# Altium schematic sheet UART.SchDoc
size A2; SheetNumber: 19; SheetTotal: 29
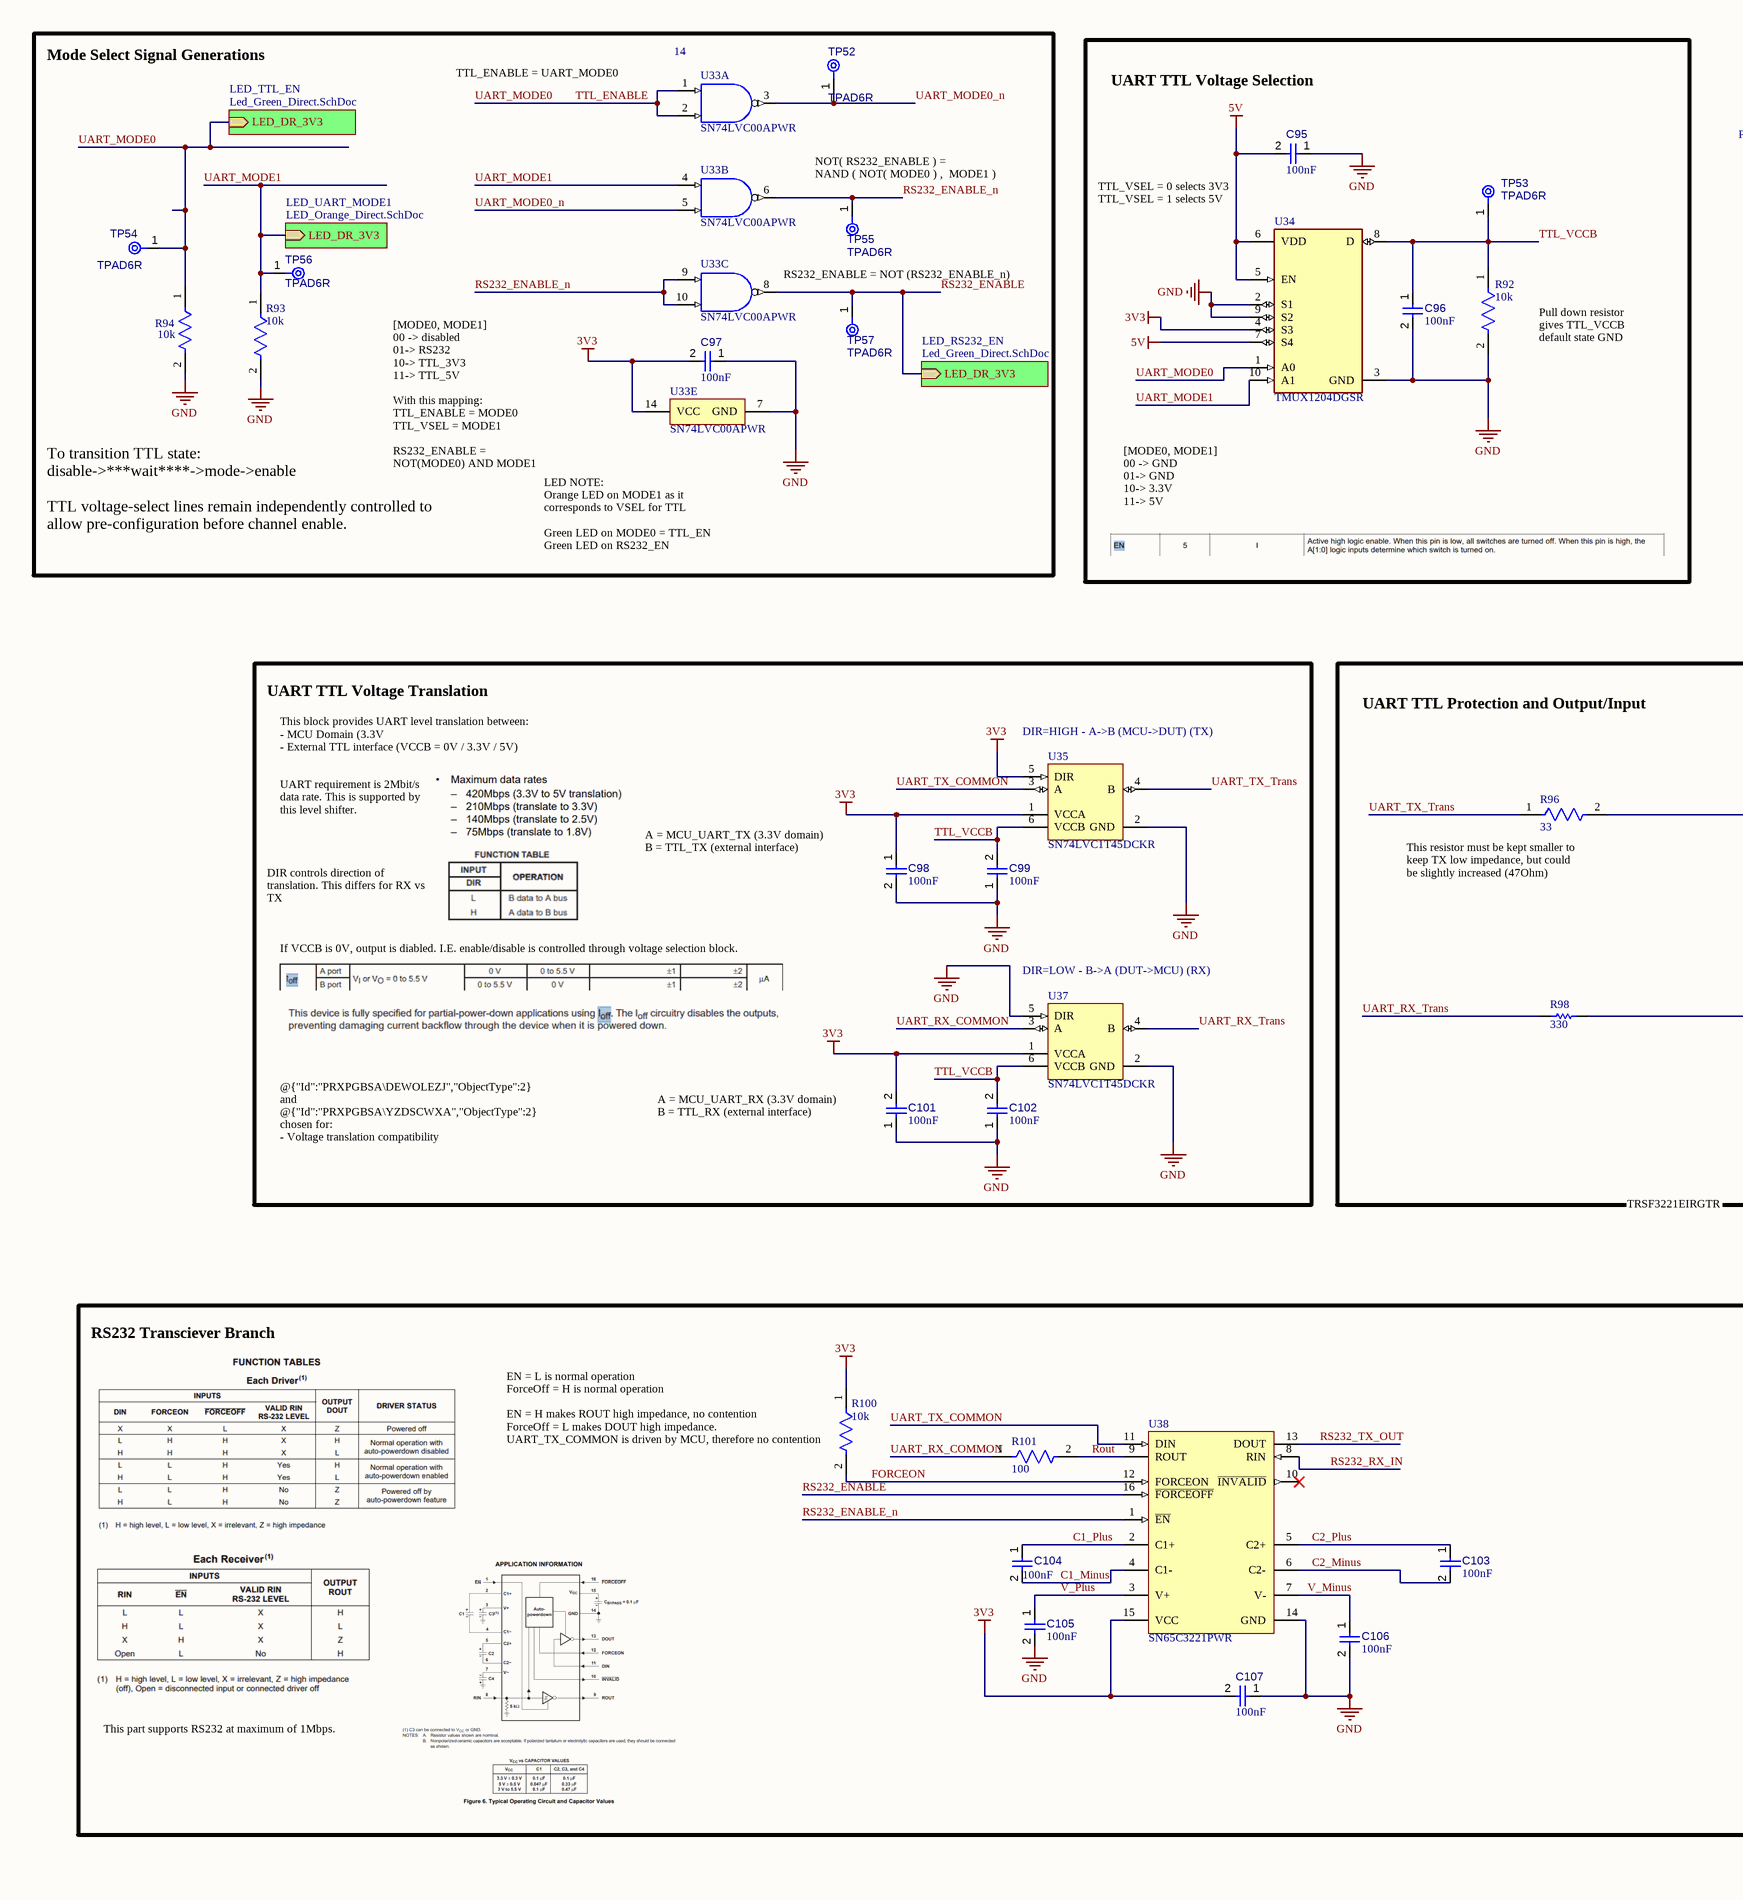
[diagram p0: UART.SchDoc, left]
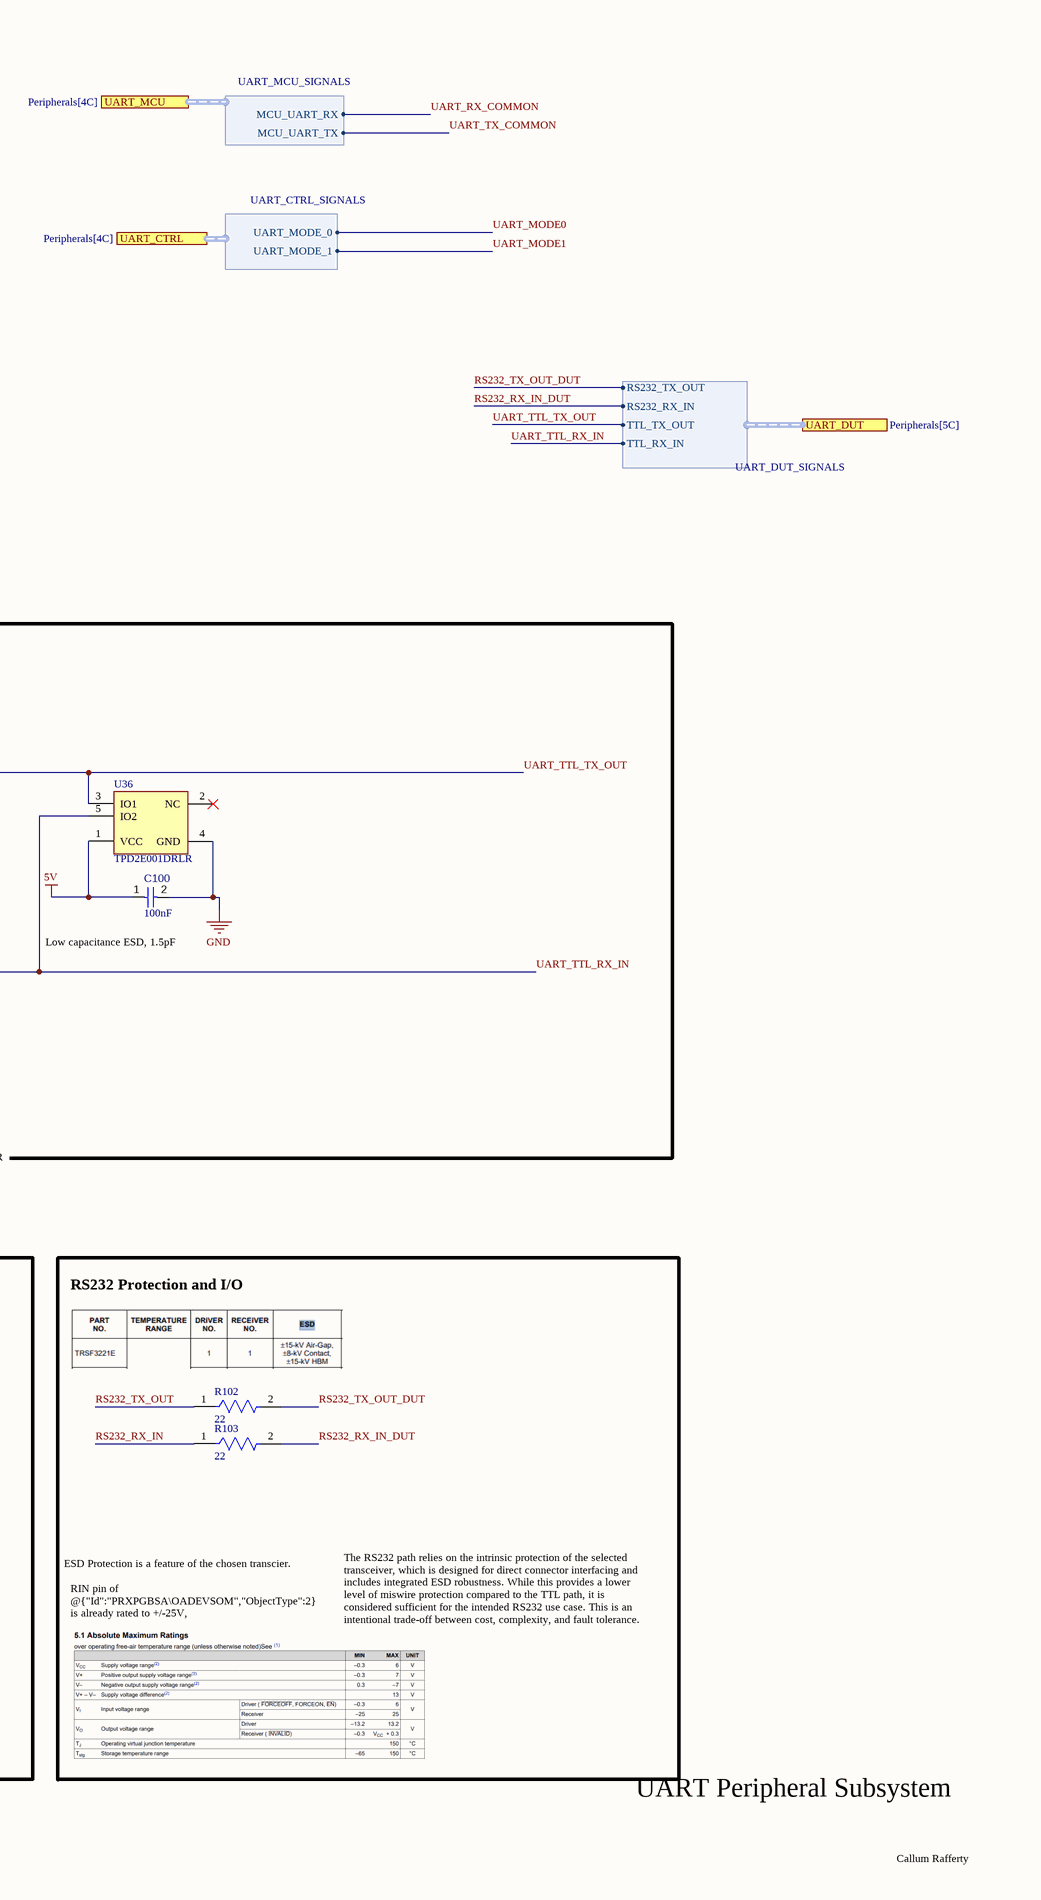
[diagram p1: UART.SchDoc, right]

## Parts
C95  value 100nF  [CAPC1608X90X40NL10T20]  (hidden comment: Capacitor 100 nF +/-10% 50 V 0603)
C96  value 100nF  [CAPC1608X90X40NL10T20]  (hidden comment: Capacitor 100 nF +/-10% 50 V 0603)
C97  value 100nF  [CAPC1608X90X40NL10T20]  (hidden comment: Capacitor 100 nF +/-10% 50 V 0603)
C98  value 100nF  [CAPC1608X90X40NL10T20]  (hidden comment: Capacitor 100 nF +/-10% 50 V 0603)
C99  value 100nF  [CAPC1608X90X40NL10T20]  (hidden comment: Capacitor 100 nF +/-10% 50 V 0603)
C100  value 100nF  [CAPC1608X90X40NL10T20]  (hidden comment: Capacitor 100 nF +/-10% 50 V 0603)
C101  value 100nF  [CAPC1608X90X40NL10T20]  (hidden comment: Capacitor 100 nF +/-10% 50 V 0603)
C102  value 100nF  [CAPC1608X90X40NL10T20]  (hidden comment: Capacitor 100 nF +/-10% 50 V 0603)
C103  value 100nF  [CAPC1608X90X40LL10T20]  (hidden comment: Capacitor 100 nF +/-10% 50 V 0603)
C104  value 100nF  [CAPC1608X90X40LL10T20]  (hidden comment: Capacitor 100 nF +/-10% 50 V 0603)
C105  value 100nF  [CAPC1608X90X40LL10T20]  (hidden comment: Capacitor 100 nF +/-10% 50 V 0603)
C106  value 100nF  [CAPC1608X90X40LL10T20]  (hidden comment: Capacitor 100 nF +/-10% 50 V 0603)
C107  value 100nF  [CAPC1608X90X40NL10T20]  (hidden comment: Capacitor 100 nF +/-10% 50 V 0603)
R92  value 10k  [FP-RT0603-IPC_C]  (hidden comment: RT0603BRD0710KL)
R93  value 10k  [FP-RT0603-IPC_C]  (hidden comment: RT0603BRD0710KL)
R94  value 10k  [FP-RT0603-IPC_C]  (hidden comment: RT0603BRD0710KL)
R96  value 33  [FP-AC0603-IPC_C]  (hidden comment: AC0603FR-0733RL)
R98  value 330  [RESC1608X55X25LL10T15]  (hidden comment: RC0603JR-07330RL)
R100  value 10k  [FP-RT0603-IPC_B]  (hidden comment: RT0603BRD0710KL)
R101  value 100  [FP-RT0603-IPC_B]  (hidden comment: RT0603BRD07100RL)
R102  value 22  [FP-RC0603-0_55-IPC_A]  (hidden comment: RC0603JR-0722RL)
R103  value 22  [FP-RC0603-0_55-IPC_A]  (hidden comment: RC0603JR-0722RL)
TP52  TPAD6R  [TP06R]  (no BOM)
TP53  TPAD6R  [TP06R]  (no BOM)
TP54  TPAD6R  [TP06R]  (no BOM)
TP55  TPAD6R  [TP06R]  (no BOM)
TP56  TPAD6R  [TP06R]  (no BOM)
TP57  TPAD6R  [TP06R]  (no BOM)
U33  SN74LVC00APWR  Pins: 14  [FP-PW0014A-IPC_B]  (parts A,B,C,E of 5)
U34  TMUX1204DGSR  [FP-DGS0010A-IPC_B]
U35  SN74LVC1T45DCKR  [DCK0006A_M]
U36  TPD2E001DRLR  [DRL0005A_M]
U37  SN74LVC1T45DCKR  [DCK0006A_M]
U38  SN65C3221PWR  [PW0016A_L]

## Blocks framed on the sheet
Mode Select Signal Generations: C97 R93 R94 TP52 TP54-TP57 U33
UART TTL Voltage Selection: C95 C96 R92 TP53 U34
UART TTL Voltage Translation: C98 C99 C101 C102 U35 U37
UART TTL Protection and Output/Input: C100 R96 R98 U36
RS232 Transciever Branch: C103-C107 R100 R101 U38
RS232 Protection and I/O: R102 R103

## Sub-sheets
LED_RS232_EN = Led_Green_Direct.SchDoc: LED_DR_3V3 (in)
LED_TTL_EN = Led_Green_Direct.SchDoc: LED_DR_3V3 (in)
LED_UART_MODE1 = LED_Orange_Direct.SchDoc: LED_DR_3V3 (in)

## Ports
UART_CTRL (harness UART_CTRL_SIGNALS, see Peripherals[4C]), UART_DUT (harness UART_DUT_SIGNALS, see Peripherals[5C]), UART_MCU (harness UART_MCU_SIGNALS, see Peripherals[4C])

## Harnesses
UART_DUT_SIGNALS: RS232_TX_OUT, RS232_RX_IN, TTL_TX_OUT, TTL_RX_IN
UART_MCU_SIGNALS: MCU_UART_RX, MCU_UART_TX
UART_CTRL_SIGNALS: UART_MODE_0, UART_MODE_1

## Nets
3V3: C97.2 C98.1 C101.2 C107.2 R100.1 U33.14(VCC) U34.4(S3) U35.1(VCCA) U35.5(DIR) U37.1(VCCA) U38.15(VCC)
5V: C95.2 C100.1 U34.5(EN) U34.6(VDD) U34.7(S4) U36.1(VCC)
GND: C95.1 C96.2 C97.1 C98.2 C99.1 C100.2 C101.1 C102.1 C105.2 C106.2 C107.1 R92.2 R93.2 R94.2 U33.7(GND) U34.2(S1) U34.3(GND) U34.9(S2) U35.2(GND) U36.4(GND) U37.2(GND) U37.5(DIR) U38.14(GND)
C1_Minus: C104.2 U38.4(C1-)
C1_Plus: C104.1 U38.2(C1+)
C2_Minus: C103.2 U38.6(C2-)
C2_Plus: C103.1 U38.5(C2+)
FORCEON: R100.2 U38.12(FORCEON)
Rout: R101.2 U38.9(ROUT)
RS232_ENABLE: TP57.1(TP) U33.8(3Y) U38.16(~{FORCEOFF}) ; sheet LED_RS232_EN/LED_DR_3V3
RS232_ENABLE_n: TP55.1(TP) U33.6(2Y) U33.9(3A) U33.10(3B) U38.1(~{EN})
RS232_RX_IN: R103.1 U38.8(RIN)
RS232_RX_IN_DUT: R103.2 ; port UART_DUT.RS232_RX_IN
RS232_TX_OUT: R102.1 U38.13(DOUT)
RS232_TX_OUT_DUT: R102.2 ; port UART_DUT.RS232_TX_OUT
TTL_ENABLE: R94.1 TP54.1(TP) U33.1(1A) U33.2(1B) U34.1(A0) ; sheet LED_TTL_EN/LED_DR_3V3, port UART_CTRL.UART_MODE_0  [also labelled UART_MODE0]
TTL_VCCB: C96.1 C99.2 C102.2 R92.1 TP53.1(TP) U34.8(D) U35.6(VCCB) U37.6(VCCB)
UART_MODE0_n: TP52.1(TP) U33.3(1Y) U33.5(2B)
UART_MODE1: R93.1 TP56.1(TP) U33.4(2A) U34.10(A1) ; sheet LED_UART_MODE1/LED_DR_3V3, port UART_CTRL.UART_MODE_1
UART_RX_COMMON: R101.1 U37.3(A) ; port UART_MCU.MCU_UART_RX
UART_RX_Trans: R98.1 U37.4(B)
UART_TTL_RX_IN: R98.2 U36.5(IO2) ; port UART_DUT.TTL_RX_IN
UART_TTL_TX_OUT: R96.2 U36.3(IO1) ; port UART_DUT.TTL_TX_OUT
UART_TX_COMMON: U35.3(A) U38.11(DIN) ; port UART_MCU.MCU_UART_TX
UART_TX_Trans: R96.1 U35.4(B)
V_Minus: C106.1 U38.7(V-)
V_Plus: C105.1 U38.3(V+)

Not connected (* = marked no-connect by the designer): U36 2(NC)*; U38 10(~{INVALID})*

## Notes on the sheet
- TTL_ENABLE = UART_MODE0
- (near TP55) NOT( RS232_ENABLE ) =
  NAND ( NOT( MODE0 ) ,  MODE1 )
- TTL_VSEL = 0 selects 3V3
  TTL_VSEL = 1 selects 5V
- RS232_ENABLE = NOT (RS232_ENABLE_n)
- Pull down resistor gives TTL_VCCB default state GND
- [MODE0, MODE1]
  00 -> disabled
  01-> RS232
  10-> TTL_3V3
  11-> TTL_5V
  With this mapping:
  TTL_ENABLE = MODE0
  TTL_VSEL = MODE1
  RS232_ENABLE = NOT(MODE0) AND MODE1
- [MODE0, MODE1]
  00 -> GND
  01-> GND
  10-> 3.3V
  11-> 5V
- To transition TTL state:
  disable->***wait****->mode->enable
  TTL voltage-select lines remain independently controlled to allow pre-configuration before channel enable.
- LED NOTE:
  Orange LED on MODE1 as it corresponds to VSEL for TTL
  Green LED on MODE0 = TTL_EN
  Green LED on RS232_EN
- This block provides UART level translation between:
  - MCU Domain (3.3V
  - External TTL interface (VCCB = 0V / 3.3V / 5V)
- (near U35) DIR=HIGH - A->B (MCU->DUT) (TX)
- UART requirement is 2Mbit/s data rate. This is supported by this level shifter.
- A = MCU_UART_TX (3.3V domain)
  B = TTL_TX (external interface)
- DIR controls direction of translation. This differs for RX vs TX
- (near R96) This resistor must be kept smaller to keep TX low impedance, but could be slightly increased (47Ohm)
- If VCCB is 0V, output is diabled. I.E. enable/disable is controlled through voltage selection block.
- (near U37) DIR=LOW - B->A (DUT->MCU) (RX)
- (near C100) Low capacitance ESD, 1.5pF
- @{"Id":"PRXPGBSA\DEWOLEZJ","ObjectType":2} and @{"Id":"PRXPGBSA\YZDSCWXA","ObjectType":2} chosen for:
  - Voltage translation compatibility
  - Automatic high-z when VCCB = 0V (disable
  - Push-pull operation suitable for UART
  - High data rate margin
  - Low Cost
- (near C101) A = MCU_UART_RX (3.3V domain)
  B = TTL_RX (external interface)
- TRSF3221EIRGTR
- (near R100) EN = L is normal operation
  ForceOff = H is normal operation
  EN = H makes ROUT high impedance, no contention
  ForceOff = L makes DOUT high impedance.
  UART_TX_COMMON is driven by MCU, therefore no contention
- ESD Protection is a feature of the chosen transcier.
- RIN pin of @{"Id":"PRXPGBSA\OADEVSOM","ObjectType":2} is already rated to +/-25V,
  DOUT pin is rated +/- 13.2V
- The RS232 path relies on the intrinsic protection of the selected transceiver, which is designed for direct connector interfacing and includes integrated ESD robustness. While this provides a lower level of miswire protection compared to the TTL path, it is considered sufficient for the intended RS232 use case. This is an intentional trade-off between cost, complexity, and fault tolerance.
- This part supports RS232 at maximum of 1Mbps.
- UART Peripheral Subsystem
- Callum Rafferty

## Library data of the parts
C95-C107 = CMP-001-00017-6: Chip Capacitor, 100 nF, +/- 10%, 50 V, 0603 (1608 Metric); Voltage Rating: 50V; Capacitor Type: Ceramic; Tolerance: 10%; Mounting Technology: SM; Max Operating Temperature: 125°C; RoHS Compliant: True; Pins: 2; Case/Package: 0603; Min Operating Temperature: -55°C
R92-R94 R100 = CMP-009-00322-1: Res Thin Film 0603 10K Ohm 0.1% 1/10W |25ppm/|C SMD Paper T/R; Voltage Rating: 75V; Max Power Dissipation: 100mW; Temperature Coefficient: 25ppm/°C; Min Operating Temperature: -55°C; Case/Package: 0603; Mounting Technology: Surface Mount; Max Operating Temperature: 155°C; Tolerance: 0.1%; Case Code (Imperial): 0603; China RoHS: Non-Compliant; Composition: Thin Film; Country of Origin: Mainland China, Taiwan; Depth: 800µm; Export Control Classification Number (ECCN) Code: EAR99; Features: Moisture Resistant; Harmonized Tariff Schedule (HTS) Code: 8533.21.00.30; Height: 450µm; Introduction Date: 2008-06-09; Lead Free: Lead Free; Length: 1.6mm; Lifecycle Status: Production; Military Standard: Not; Number of Terminals: 2; Number of Terminations: 2; Power Rating: 100mW; REACH SVHC: Yes; RoHS: Compliant; Schedule B: 8533210045, 8533210045; Termination: SMD/SMT; Voltage Rating (DC): 75V; Weight: 2.012816mg; Width: 800µm; Working Voltage: 75V
R96 = CMP-009-00258-1: Res Thick Film 0603 33 Ohm 1% 0.1W(1/10W) ±100ppm/C Pad SMD T/R Automotive AEC-Q200; Voltage Rating: 75V; Max Power Dissipation: 100mW; Temperature Coefficient: 100ppm/°C; Min Operating Temperature: -55°C; Tolerance: 1%; Mounting Technology: Surface Mount; Max Operating Temperature: 155°C; Case/Package: 0603; Case Code (Imperial): 0603; China RoHS: Non-Compliant; Composition: Thick Film; Country of Origin: Mainland China, Taiwan; Export Control Classification Number (ECCN) Code: EAR99; Harmonized Tariff Schedule (HTS) Code: 8533.21.00.30; Height: 450µm; Introduction Date: 2012-04-10; Length: 1.6mm; Lifecycle Status: Production; Number of Terminals: 2; Number of Terminations: 2; Power Rating: 100mW; REACH SVHC: Yes; RoHS: Compliant; Schedule B: 8533210045, 8533210045; Termination: SMD/SMT; Width: 800µm; Working Voltage: 75V; Case Code (Metric): 1608; Features: Automotive AEC-Q200, Moisture Resistant; Packaging: Tape & Reel; Power Dissipation: 100mW; Ratings: AEC-Q200
R98 = CMP-009-00349-1: Res Thick Film 0603 330 Ohm 5% 0.1W(1/10W) ±100ppm/C Epoxy SMD T/R; Voltage Rating (AC): 50V; Power Rating: 100mW; Temperature Coefficient: 100ppm/°C; Working Voltage: 75V; Case/Package: 0603; Voltage Rating: 50V; Schedule B: 8533210045, 8533210045; Length: 1.6mm; Packaging: Cut Tape; Width: 800µm; RoHS: Compliant; Tolerance: 5%; Termination: SMD/SMT; Number of Terminals: 2; Voltage Rating (DC): 50V; Max Operating Temperature: 155°C; Lead Free: Lead Free; Lifecycle Status: Production; REACH SVHC: Yes; Case Code (Imperial): 0603; Height: 450µm; Depth: 800µm; China RoHS: Non-Compliant; Pins: 2; Min Operating Temperature: -55°C; Composition: Thick Film; Mounting Technology: Surface Mount; Country of Origin: Mainland China, Taiwan; Export Control Classification Number (ECCN) Code: EAR99; Harmonized Tariff Schedule (HTS) Code: 8533.21.00.30; Introduction Date: 2004-09-22; Military Standard: Not
R101 = CMP-009-00335-1: 100mW Thin Film Resistor 75V ±25ppm/℃ ±0.1% 100Ω 0603 Chip Resistor - Surface Mount ROHS; Temperature Coefficient: 25ppm/°C; Height: 450µm; Min Operating Temperature: -55°C; China RoHS: Non-Compliant; Power Rating: 100mW; Composition: Thin Film; Number of Terminals: 2; REACH SVHC: Yes; Tolerance: 0.1%; Length: 1.6mm; Mounting Technology: Surface Mount; Working Voltage: 75V; Lifecycle Status: Production; Voltage Rating: 75V; RoHS: Compliant; Width: 800µm; Max Operating Temperature: 155°C; Case/Package: 0603; Case Code (Imperial): 0603; Country of Origin: Mainland China, Taiwan; Depth: 800µm; Export Control Classification Number (ECCN) Code: EAR99; Features: Moisture Resistant; Harmonized Tariff Schedule (HTS) Code: 8533.21.00.30; Introduction Date: 2008-06-09; Lead Free: Lead Free; Max Power Dissipation: 100mW; Military Standard: Not; Number of Terminations: 2; Schedule B: 8533210045, 8533210045; Termination: SMD/SMT; Voltage Rating (DC): 75V; Weight: 2.012816mg
R102 R103 = CMP-009-00321-1: 100mW Thick Film Resistors 75V ±100ppm/℃ ±5% 22Ω 0603 Chip Resistor - Surface Mount ROHS; Temperature Coefficient: 100ppm/°C; Voltage Rating: 50V; Tolerance: 5%; Lifecycle Status: Production; Lead Free: Lead Free; Termination: SMD/SMT; Case/Package: 0603; Military Standard: Not; Working Voltage: 75V; Max Operating Temperature: 155°C; Pins: 2; Composition: Thick Film; REACH SVHC: Yes; Min Operating Temperature: -55°C; Power Rating: 100mW; Width: 800µm; Voltage Rating (AC): 50V; China RoHS: Non-Compliant; Country of Origin: Mainland China, Taiwan; Depth: 800µm; Height: 450µm; Schedule B: 8533210045, 8533210045; Number of Terminals: 2; RoHS: Compliant; Voltage Rating (DC): 50V; Length: 1.6mm; Mounting Technology: Surface Mount; Radiation Hardening: No; Harmonized Tariff Schedule (HTS) Code: 8533.21.00.30; Contact Plating: Tin; Export Control Classification Number (ECCN) Code: EAR99; Packaging: Tape & Reel; Case Code (Imperial): 0603; Introduction Date: 2004-09-22
TP52-TP57 = CMP-00028-00002-2: 0.6mm round; Pins: 1
U33 = CMP-016-00024-1: 4.1NS@ 3.3V, 50PF 1 2 4 4 1.65V 3.6V 24MA Nand Gate Lvc 24MA TSSOP-14 , 1.2MM; Manufacturer Lifecycle Status: ACTIVE; Number of Outputs: 1; Turn-On Delay Time: 4.3ns; Propagation Delay: 3.5ns; High Level Output Current: -24mA; Number of Inputs: 2; Number of Bits: 4; Nominal Supply Current: 1µA; Max Junction Temperature (Tj): 150°C; Schmitt Trigger Input: No; Case/Package: TSSOP; Length: 5mm; Lead Free: Lead Free; Radiation Hardening: No; Min Operating Temperature: -40°C; Weight: 57.209338mg; Packaging: Tape & Reel; RoHS: Compliant; Height: 0m; Mounting Technology: Surface Mount; Number of Input Lines: 2; Thickness: 1mm; Width: 4.4mm; Min Supply Voltage: 1.65V; Logic Function: NAND; Quiescent Current: 1µA; Low Level Output Current: 24mA; Lifecycle Status: Production; Number of Elements: 4; Max Operating Temperature: 125°C; Number of Gates: 4; Number of Circuits: 4; Number of Output Lines: 1; Max Supply Voltage: 3.6V; Contact Plating: Gold; Max Output current: 24mA; Number of Channels: 4; Output Current: 24mA; REACH SVHC: No; Schedule B: 8542390000, 8542390000; Termination: SMD/SMT
U34 = CMP-011-00021-1: 5V, 4: 1, 1-channel, analog multiplexer, 1.8V compatible logic 10-VSSOP -40 to 125; Manufacturer Lifecycle Status: ACTIVE; Value: 9Ω; Number of Channels: 1; Max Junction Temperature (Tj): 150°C; -3db Bandwidth: 125MHz; Min Supply Voltage: 1.08V; Throw Configuration: SP4T; Nominal Supply Current: 10nA; Max Supply Voltage: 5.5V; On-State Resistance: 5Ω; Lifecycle Status: Production; Schedule B: 8542390000, 8542390000; Min Operating Temperature: -40°C; Thickness: 1.02mm; Max Operating Temperature: 125°C; Ambient Temperature Range High: 125°C; Case/Package: VSSOP; Width: 3mm; RoHS: Compliant; Number of Circuits: 1; Height: 1.07mm; Length: 3mm; Pins: 10
U35 U37 = CMP-016-00013-1: Translators, Level Shifters bidirectional 420Mbps 1.65V~5.5VCCA 1.65V~5.5VCCB; Manufacturer Lifecycle Status: ACTIVE; Min Supply Voltage: 1.65V; Number of Elements: 1; Quiescent Current: 3µA; Logic Function: Transceiver, Translator; Propagation Delay: 3.9ns; Low Level Output Current: 32mA; Topology: Push-Pull; Turn-On Delay Time: 17.7ns; Polarity: Non-Inverting; High Level Output Current: -32mA; Max Supply Voltage: 5.5V; Lead Free: Lead Free; Min Operating Temperature: -40°C; Radiation Hardening: No; Lifecycle Status: Production; Mounting Technology: Surface Mount; RoHS: Compliant; Length: 2mm; Direction: Bidirectional; Packaging: Cut Tape; Pins: 6; Width: 1.25mm; Case/Package: SC; Data Rate: 420Mbps; Schedule B: 8542390000, 8542390000; Min Supply Voltage (DC): 1.65V; Height: 1.1mm; Max Operating Temperature: 85°C; Number of Channels: 1; Thickness: 900µm; Weight: 2.494758mg; Number of Bits: 1; Contact Plating: Gold; REACH SVHC: No
U36 = CMP-004-00058-1: 11V Unidirectional 5.5V SOT-553-5 ESD and Surge Protection (TVS/ESD) ROHS; Manufacturer Lifecycle Status: ACTIVE; Leakage Current: 1nA; Power Line Protection: Yes; Interface: Ethernet, LVDS; Element Configuration: Dual; Number of Channels: 2; Min Supply Voltage: 900mV; Clamping Voltage: 105.5V; Max Junction Temperature (Tj): 150°C; Peak Pulse Current: 10A; Value: 1.5pF; REACH SVHC: No; Width: 1.2mm; Weight: 2.806603mg; Pins: 5; Min Operating Temperature: -40°C; Breakdown Voltage: 11V; Lifecycle Status: Production; RoHS: Compliant; Termination: SMD/SMT; Working Voltage: 5.5V; Radiation Hardening: No; Thickness: 550µm; Length: 1.6mm; Contact Plating: Gold; Number of Outputs: 2; Max Operating Temperature: 85°C; Height: 0m; Min Breakdown Voltage: 11V; Polarity: Unidirectional; Ambient Temperature Range High: 85°C; Lead Free: Lead Free; Depth: 1.2mm; Schedule B: 8541100080, 8541100080; Reverse Standoff Voltage: 5.5V; Operating Supply Voltage: 5.5V; Max Supply Voltage: 5.5V; Number of Bidirectional Channels: 2; Direction: Unidirectional; Case/Package: SOT
U38 = CMP-015-00013-1: 3- to 5.5-V single channel 1Mbps RS-232 line driver/receiver with +/-15-kV ESD protection 16-TSSOP -40 to 85; Manufacturer Lifecycle Status: ACTIVE; Nominal Supply Current: 1mA; Number of Receivers: 1; Operating Supply Voltage: 5V; Simplex/Duplex: Full Duplex; Logic Function: Receiver, Transceiver; Max Supply Voltage: 5.5V; Min Supply Voltage: 3V; RoHS: Compliant; Thickness: 1mm; Number of Drivers: 1; Data Rate: 1Mbps; Number of Transceivers: 1; Pins: 16; Lifecycle Status: Production; Operating Supply Current: 1mA; Weight: 61.887009mg; Mounting Technology: Surface Mount; Schedule B: 8542390000, 8542390000; Radiation Hardening: No; REACH SVHC: No; Height: 1.2mm; Number of Transmitters: 1; Width: 4.4mm; Max Operating Temperature: 85°C; Length: 5mm; Lead Free: Lead Free; Case/Package: TSSOP; Min Operating Temperature: -40°C